# EAGLE design PowerBoard (EAGLE 9.1.3)
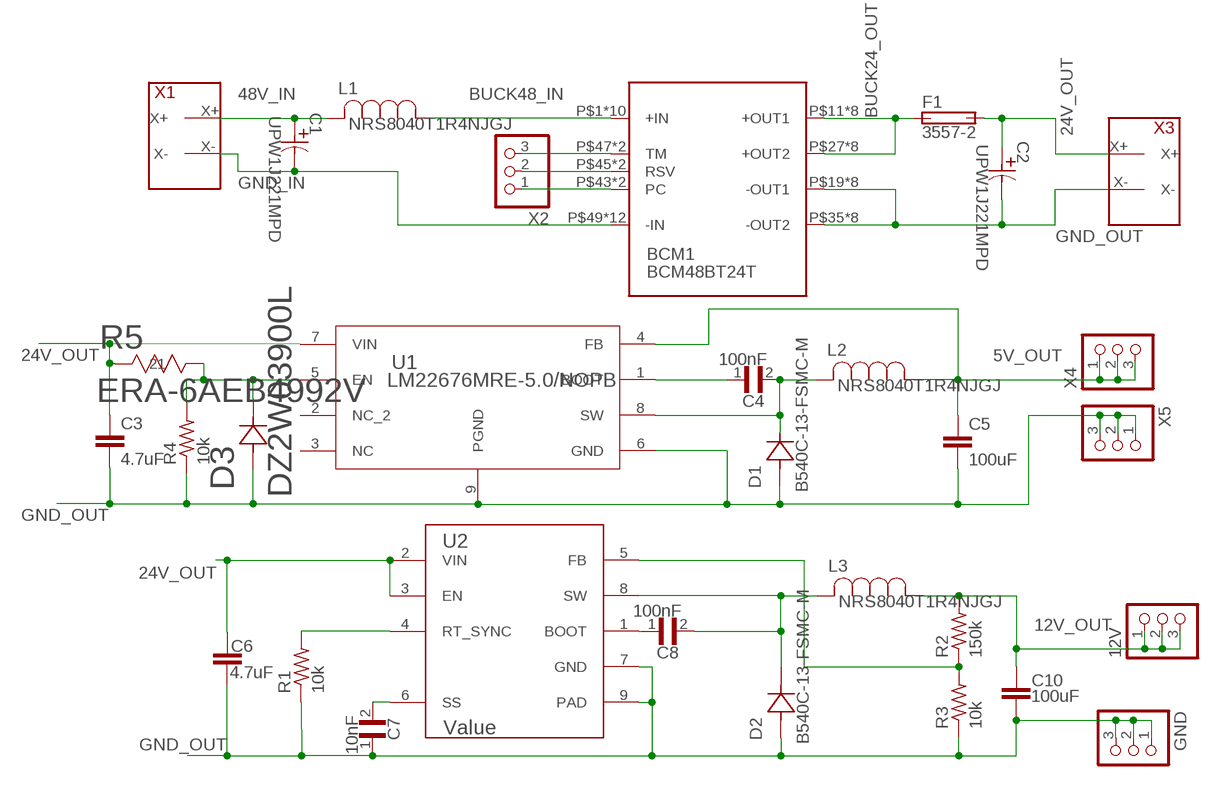
[diagram p0: schematic, sheet 1]

## Parts
12V  9-146281-0  [TE_9-146281-0]
BCM1  BCM48BT24T  [BCM48BT24T]
C1  UPW1J221MPD  [PCAP_10X20-THRU-ELECT]
C2  UPW1J221MPD  [PCAP_10X20-THRU-ELECT]
C3  4.7uF  4.7UF0603  [0603]
C4  100nF  GRM21BR60E107ME15L  [CAPC2012X135N]
C5  100uF  10UF-1210-50V-20%  [1210]
C6  4.7uF  4.7UF0603  [0603]
C7  10nF  GRM21BR60E107ME15L  [CAPC2012X135N]
C8  100nF  GRM21BR60E107ME15L  [CAPC2012X135N]
C10  100uF  10UF-1210-50V-20%  [1210]
D1  B540C-13-FSMC-M  [SMC-M]
D2  B540C-13-FSMC-M  [SMC-M]
D3  DZ2W03900L  [MINI2-F3-B]
F1  3557-2  [FUSE_3557-2]
GND  9-146281-0  [TE_9-146281-0]
L1  NRS8040T1R4NJGJ  [IND_TAIYO_NRS8040]
L2  NRS8040T1R4NJGJ  [IND_TAIYO_NRS8040]
L3  NRS8040T1R4NJGJ  [IND_TAIYO_NRS8040]
R1  10k  R-US_R0603  [R0603]
R2  150k  R-US_R0603  [R0603]
R3  10k  R-US_R0603  [R0603]
R4  10k  R-US_R0603  [R0603]
R5  ERA-6AEB4992V  [RES_ERA6A_0805]
U1  LM22676MRE-5.0/NOPB  [MRA08B]
U2  Value  LMR14050SDDAR  [DDA0008E_N]
X1  XT60  [XT60]
X2  9-146281-0  [TE_9-146281-0]
X3  XT60  [XT60]
X4  9-146281-0  [TE_9-146281-0]
X5  9-146281-0  [TE_9-146281-0]

## Nets
5V_OUT [V5]: C5.1 L2.1 U1.4(FB) X4.1 X4.2 X4.3
12V_OUT [V12]: 12V.1 12V.2 12V.3 C10.1 L3.1 R2.2
24V_OUT [V24]: C2.1 C3.1 C6.1 F1.3(2A) F1.4(2A) R5.2 U1.7(VIN) U2.2(VIN) U2.3(EN) X3.X+
48V_IN [V48]: C1.1 L1.2 X1.X+
BUCK24_OUT [V24]: BCM1.P$11(+OUT1) BCM1.P$12(+OUT1) BCM1.P$13(+OUT1) BCM1.P$14(+OUT1) BCM1.P$15(+OUT1) BCM1.P$16(+OUT1) BCM1.P$17(+OUT1) BCM1.P$18(+OUT1) BCM1.P$27(+OUT2) BCM1.P$28(+OUT2) BCM1.P$29(+OUT2) BCM1.P$30(+OUT2) BCM1.P$31(+OUT2) BCM1.P$32(+OUT2) BCM1.P$33(+OUT2) BCM1.P$34(+OUT2) F1.1(1A) F1.2(1A)
BUCK48_IN [V48]: BCM1.P$1(+IN) BCM1.P$2(+IN) BCM1.P$3(+IN) BCM1.P$4(+IN) BCM1.P$5(+IN) BCM1.P$6(+IN) BCM1.P$7(+IN) BCM1.P$8(+IN) BCM1.P$9(+IN) BCM1.P$10(+IN) L1.1
GND_IN [GND_IN]: BCM1.P$49(-IN) BCM1.P$50(-IN) BCM1.P$51(-IN) BCM1.P$52(-IN) BCM1.P$53(-IN) BCM1.P$54(-IN) BCM1.P$55(-IN) BCM1.P$56(-IN) BCM1.P$57(-IN) BCM1.P$58(-IN) BCM1.P$59(-IN) BCM1.P$60(-IN) C1.2 X1.X-
GND_OUT [GND_OUT]: BCM1.P$19(-OUT1) BCM1.P$20(-OUT1) BCM1.P$21(-OUT1) BCM1.P$22(-OUT1) BCM1.P$23(-OUT1) BCM1.P$24(-OUT1) BCM1.P$25(-OUT1) BCM1.P$26(-OUT1) BCM1.P$35(-OUT2) BCM1.P$36(-OUT2) BCM1.P$37(-OUT2) BCM1.P$38(-OUT2) BCM1.P$39(-OUT2) BCM1.P$40(-OUT2) BCM1.P$41(-OUT2) BCM1.P$42(-OUT2) C2.2 C3.2 C5.2 C6.2 C7.1 C10.2 D1.2 D2.2 D3.2 GND.1 GND.2 GND.3 R1.1 R3.1 R4.1 U1.6(GND) U1.9(PGND) U2.7(GND) U2.9(PAD) X3.X- X5.1 X5.2 X5.3
N$3: C4.1 U1.1(BOOT)
N$5 [V24]: D3.1 R4.2 R5.1 U1.5(EN)
N$6: BCM1.P$43(PC) BCM1.P$44(PC) X2.1
N$7: C4.2 D1.1 L2.2 U1.8(SW)
N$8: BCM1.P$45(RSV) BCM1.P$46(RSV) X2.2
N$9: BCM1.P$47(TM) BCM1.P$48(TM) X2.3
N$10: C7.2 U2.6(SS)
N$11: R1.2 U2.4(RT_SYNC)
N$12: C8.1 U2.1(BOOT)
N$13: C8.2 D2.1 L3.2 U2.8(SW)
N$14: R2.1 R3.2 U2.5(FB)
Unconnected: U1.2(NC_2) U1.3(NC)

## Library data of the parts
12V GND X2 X4 X5 = header_connector:9-146281-0: AMPMODU 40 Position Through-Hole Single Row Straight 2.54 mm Breakaway Header; AVAILABILITY: Good; CENTERLINE_PITCH: 2.54 mm[.1 in]; COMMENT: 9-146281-0; DESCRIPTION: 40 MODII HDR SRST B/A .100CL; EU_ROHS_COMPLIANCE: Compliant; LINK: http://www.te.com/usa-en/product-9-146281-0.html; MF: TE Connectivity; MP: 9-146281-0; NUMBER_OF_POSITIONS: 40; PACKAGE: FakePackage u; PRICE: 2.90 USD; PRODUCT_TYPE: Connector
BCM1 = BCM48BT24:BCM48BT24T
C1 C2 = CAP220uFTH:UPW1J221MPD; MANUFACTURER_PART_NUMBER: UPW1J221MPD; VENDOR: Nichicon
C3 C6 = SparkFun-Capacitors:4.7UF: 4.7µF ceramic capacitors A capacitor is a passive two-terminal electrical component used to store electrical energy temporarily in an electric field.; PROD_ID: CAP-08280
C4 C7 C8 = GRM21BR60E107ME15L:GRM21BR60E107ME15L: Cap Ceramic 100uF 2.5V X5R 20% SMD 0805 85°C Embossed Plastic T/R; AVAILABILITY: Unavailable; DESCRIPTION: Cap Ceramic 100uF 2.5V X5R 20% SMD 0805 85°C Embossed Plastic T/R; MF: Murata Electronics; MP: GRM21BR60E107ME15L; PACKAGE: 0805 Murata; PRICE: 0.64 USD
C5 C10 = SparkFun-Capacitors:10UF: 10.0µF ceramic capacitors A capacitor is a passive two-terminal electrical component used to store electrical energy temporarily in an electric field.; PROD_ID: CAP-09824; VALUE: 10uF
D1 D2 = DIO_B540C-13-FSMC:B540C-13-F; MANUFACTURER_PART_NUMBER: B540C13F; VENDOR: Diodes Inc
D3 = 3.9V_Zener_Diode:DZ2W03900L; MANUFACTURER_PART_NUMBER: DZ2W03900L; VENDOR: Panasonic
F1 = Fuse Holder 3557-2:3557-2: Clip; Auto Clips & Holders; 2-1 Holder For Standard & Low Profile Mini Fuses; AVAILABILITY: Good; DESCRIPTION: Clip; Auto Clips & Holders; 2-1 Holder For Standard & Low Profile Mini Fuses; MF: Keystone; MP: 3557-2; PACKAGE: None; PRICE: 0.82 USD
L1-L3 = IND_smd_1uH_6A:NRS8040T1R4NJGJ; MANUFACTURER_PART_NUMBER: NRS8040T1R4NJGJ; VENDOR: TAIYO YUDEN
R1-R4 = resistor:R-US_: RESISTOR, American symbol
R5 = 50k 0805 resistor:ERA-6AEB4992V; MANUFACTURER_PART_NUMBER: ERA6AEB4992V; VENDOR: Panasonic
U1 = LM2267:LM22676MRE-5.0/NOPB; MANUFACTURER_PART_NUMBER: LM22676MRE5.0NOPB; VENDOR: National Semiconductor
U2 = 24vto12v:LMR14050SDDAR; APPLICATION_BUILDNUMBER: *; COMPTYPE: IC; MANUFACTURER: Texas Instruments; MANUFACTURER_NAME: Texas Instruments; MANUFACTURER_PART_NUMBER: LMR14050SDDAR; MOUNTTYPE: SMT; PACKAGEREFERENCE: DDA0008E; PARTNUMBER: LMR14050SDDAR; PIN_COUNT: 9; REFDES: RefDes; ROHS: Y; TYPE: TYPE
X1 X3 = XT60:XT60

## Net classes
0 default: width 0.61 mm, clearance 0.381 mm
1 V48: width 2.54 mm, clearance 0.381 mm
2 V24: clearance 0.381 mm
3 V12: width 0.762 mm, clearance 0.381 mm
4 V5: width 1.016 mm, clearance 0.381 mm
5 GND_IN: width 2.54 mm, clearance 0.381 mm
6 GND_OUT: width 0.406 mm, clearance 0.381 mm

## Board
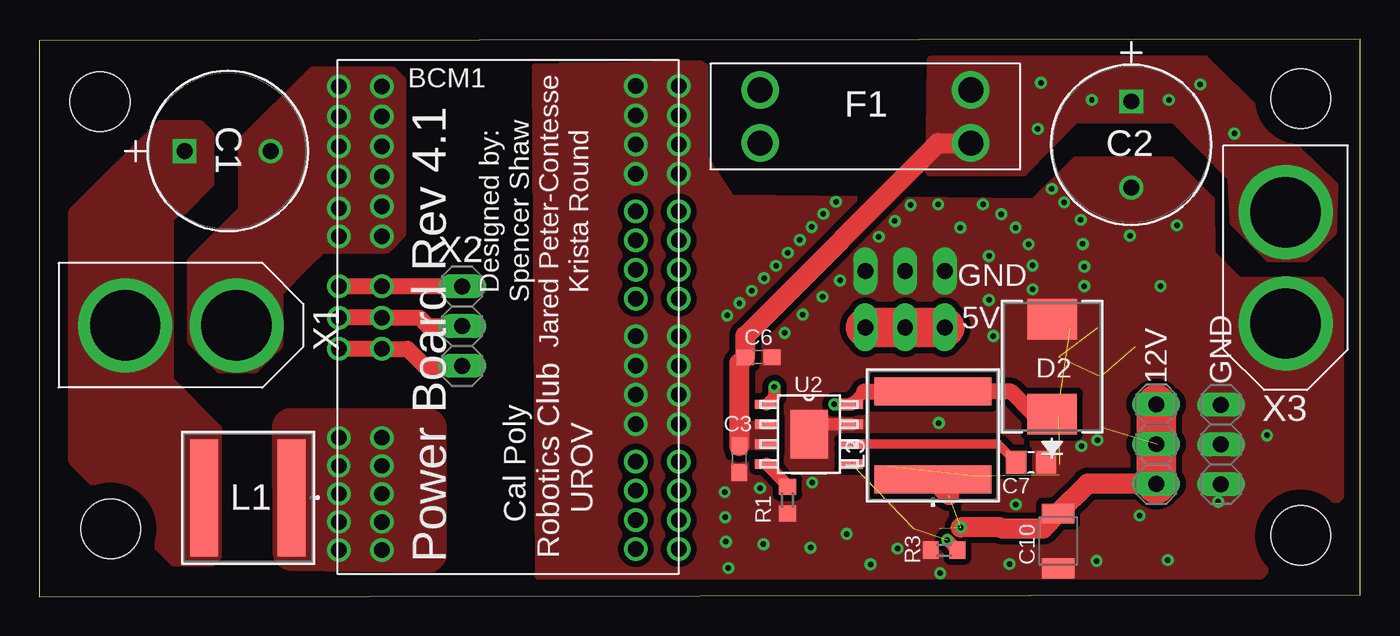
[diagram p1: board, top side]
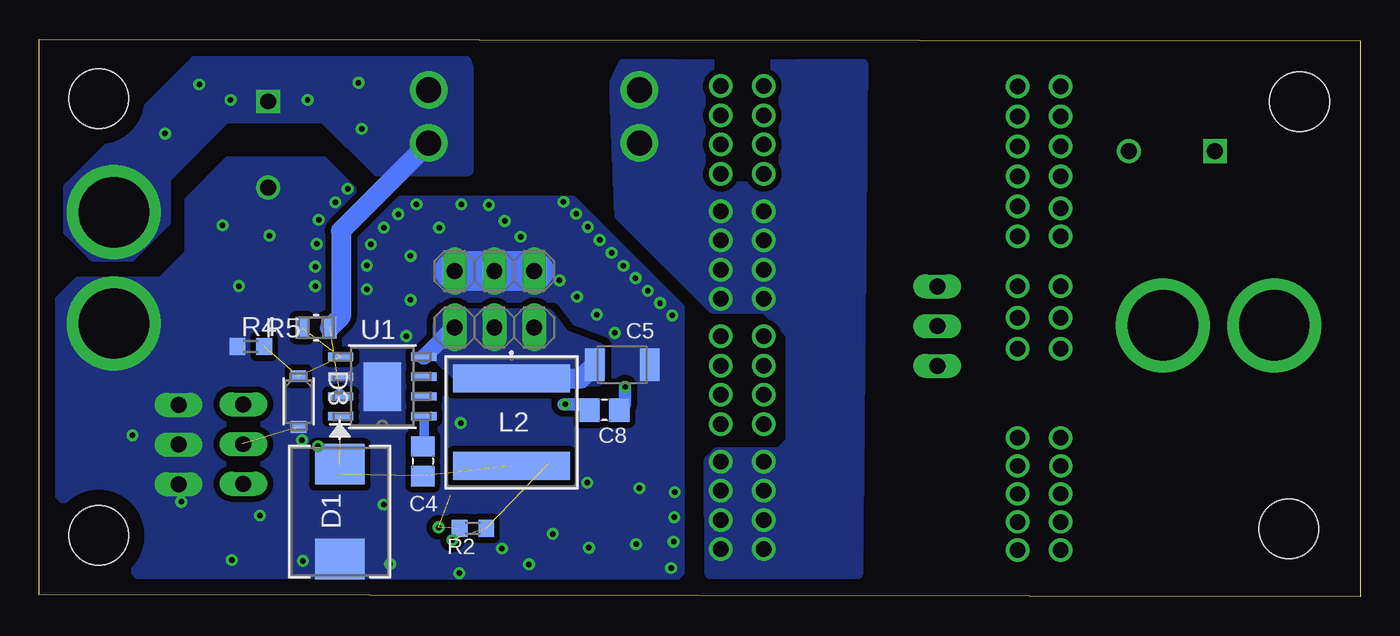
[diagram p2: board, bottom side, seen from below]

Size 84.48 x 35.66 mm. Coordinates in mm from the lower left corner, seen from the top.
Outline: 0,0 84.48,0.1 84.48,35.66 0,35.56 0,0
Copper layers (1*16): Top 0.035mm / dielectric 1.5mm / Bottom 0.035mm
Design rules "default *": minimum track width 6mil, minimum drill 0.35mm, track to track 6mil, track to pad 6mil, pad to pad 6mil, via to via 6mil, smd to smd 6mil, copper to edge 40mil, drill to drill 6mil, minimum pad ring 10mil, minimum via ring 8mil, stop-mask expansion 4mil, vias tented up to drill 0mil, thermal gap 10mil
Holes 3.81 mm at 3.89,31.65 4.57,4.34 80.67,3.91 80.67,31.85

### Footprints (pad centres in the part's own frame; a part is rotated, then mirrored left to right if it is on the bottom)
TE_9-146281-0 = drill 1.016 long: 1 1.27,0; 2 3.81,0; 3 6.35,0
BCM48BT24T = drill 0.99 pad 1.5: P$1 7.95,14.89; P$2 10.7,14.89; P$3 10.7,13.1; P$4 7.95,13.1; P$5 10.7,11.31; P$6 7.95,11.31; P$7 10.719,9.52; P$8 7.95,9.52; P$9 10.7,7.73; P$10 7.95,7.73; P$11 -11.04,14.85; P$12 -8.29,14.85; P$13 -11.04,12.98; P$14 -8.29,12.98; P$15 -11.04,11.11; P$16 -8.29,11.11; P$17 -11.04,9.24; P$18 -8.29,9.24; P$19 -11.04,6.85; P$20 -8.29,6.85; P$21 -11.04,4.98; P$22 -8.29,4.98; P$23 -11.04,3.11; P$24 -8.29,3.11; P$25 -11.04,1.24; P$26 -8.29,1.24; P$27 -11.04,-1.16; P$28 -8.29,-1.16; P$29 -11.04,-3.03; P$30 -8.29,-3.03; P$31 -11.04,-4.9; P$32 -8.29,-4.9; P$33 -11.04,-6.77; P$34 -8.29,-6.77; P$35 -11.04,-9.16; P$36 -8.29,-9.16; P$37 -11.04,-11.03; P$38 -8.29,-11.03; P$39 -11.04,-12.9; P$40 -8.29,-12.9; P$41 -11.04,-14.77; P$42 -8.29,-14.77; P$43 10.7,2.04; P$44 7.95,2.04; P$45 10.7,0.04; P$46 7.95,0.04; P$47 10.7,-1.96; P$48 7.95,-1.96; P$49 10.7,-5.17; P$50 7.95,-5.17; P$51 10.7,-6.96; P$52 7.95,-7.09; P$53 10.7,-9; P$54 7.95,-9; P$55 10.7,-10.92; P$56 7.95,-10.92; P$57 10.7,-12.83; P$58 7.95,-12.83; P$59 10.7,-14.75; P$60 7.95,-14.75
PCAP_10X20-THRU-ELECT = drill 1.016 pad 1.524 square: 1 -2.972,0 | drill 1.016 pad 1.524: 2 2.54,0
0603 = smd 1.1 x 1: 1 -0.85,0; 2 0.85,0
CAPC2012X135N = smd 1.3 x 1.5: 1 -0.95,0; 2 0.95,0
1210 = smd 1.27 x 2.06: 1 -1.755,0; 2 1.755,0
SMC-M = smd 2.587 x 3.18: 1 -3.026,0; 2 3.026,0
MINI2-F3-B = smd 0.762 x 0.991: 1 -1.626,0; 2 1.626,0
FUSE_3557-2 = drill 1.6: 1 -6.735,1.7; 2 -6.735,-1.7; 3 6.735,1.7; 4 6.735,-1.7
IND_TAIYO_NRS8040 = smd 1.791 x 7.493: 1 -2.8,0; 2 2.8,0
R0603 = smd 1 x 1.1: 1 -0.85,0; 2 0.85,0
RES_ERA6A_0805 = smd 0.864 x 1.346: 1 -0.876,0; 2 0.876,0
MRA08B = smd 1.6 x 0.533: 1 -2.654,1.905; 2 -2.654,0.635; 3 -2.654,-0.635; 4 -2.654,-1.905; 5 2.654,-1.905; 6 2.654,-0.635; 7 2.654,0.635; 8 2.654,1.905 | smd 2.413 x 3.099: 9 0,0
DDA0008E_N = smd 1.45 x 0.6: 1 -2.725,1.905; 2 -2.725,0.635; 3 -2.725,-0.635; 4 -2.725,-1.905; 5 2.725,-1.905; 6 2.725,-0.635; 7 2.725,0.635; 8 2.725,1.905 | smd 2.4 x 3.1: 9 0,0
XT60 = drill 4.5 pad 6: X+ 0,-3.56; X- 0,3.56

### Placement (x,y rotation side)
12V  71.42,5.94 90 top
BCM1  29.87,17.88 180 top
C1  12.27,28.5 0 top
C2  69.82,28.7 270 top
C3  44.75,8.79 270 top
C4  59.94,8.66 270 bottom
C5  47.19,14.83 0 bottom
C6  46,15.32 0 top
C7  63.42,8.59 180 top
C8  48.34,11.94 180 bottom
C10  65.15,3.56 270 top
D1  65.25,5.44 270 bottom
D2  64.77,14.71 90 top
D3  67.89,12.47 270 bottom
F1  52.83,30.71 0 top
GND  75.56,5.92 90 top
L1  13.36,6.32 180 top
L2  54.28,11.15 270 bottom
L3  57.15,10.31 90 top
R1  47.85,6.17 90 top
R2  56.74,4.37 180 bottom
R3  57.86,2.97 0 top
R4  70.94,16 0 bottom
R5  66.78,17.2 0 bottom
U1  62.53,13.44 180 bottom
U2  49.23,10.39 0 top
X1  9.07,17.35 270 top
X2  27.05,13.49 90 top
X3  79.71,21.03 180 top
X4  51.56,17.22 180 bottom
X5  51.56,20.83 180 bottom

### Tracks (layer width: path | path; a pad name or v marks a point on that pad's centre or on a via)
5V_OUT
  Top 2.54: X4.1 X4.2 X4.3
  Bottom 1.016: U1.4 58,17.22 X4.3
  Bottom 1.27: L2.1 49.83,13.95 C5.1
  pour Bottom (no thermals): 51.1,16.51 48.87,15.67 48.95,14.05 51.36,14.1 57.4,14.1 57.4,14.2 58.67,15.47 58.67,17.42 58.27,17.83 52.78,17.83 52.15,17.86
12V_OUT  (via drill 0.35)  (2 unrouted)
  Top 1.27: 58.18,6.49 L3.1 | v58.93,4.43 61.5,4.43 61.58,4.34 64.18,4.34 C10.1 67.05,7.21 12V.1
  Top 2.54: 12V.3 12V.2 12V.1
24V_OUT  (via drill 0.35)  (1 unrouted)
  Top 1.27: C3.1 44.75,14.92 C6.1 45.15,16.68 57.48,29.01 F1.4
  Bottom 0.813: U1.7 65.28,12.89
  Bottom 1.27: F1.4 65.18,23.4 65.18,17.92 R5.2
  other vias: 64.06,32.87 74.24,32.77 76.43,29.62 63.86,29.92 67.31,31.78 72.24,31.78
  pour Top (no thermals): 57.05,34.32 56.95,27.18 62.89,27.15 66.27,30.58 72.57,30.53 76.3,26.77 76.4,23.93 78.64,21.69 81,21.69 82.68,23.32 82.78,26.29 74.45,34.39
  pour Bottom (no thermals): 57.1,33.83 57.1,27.28 62.84,27.28 66.24,30.66 72.59,30.66 76.45,26.77 76.45,24 78.66,21.79 81,21.82 82.55,23.37 82.55,26.16 74.42,34.29 57.33,34.29 57.23,34.19
  pour Top (no thermals): 47.19,9.47 44.53,9.47 44.32,9.68 44.32,11.02 44.45,11.15 47.12,11.15 47.19,11.15 47.19,9.63
48V_IN
  pour Top (no thermals): 11.43,10.77 11.43,2.57 11.23,2.36 11.02,2.16 8.64,2.16 2.13,8.66 2.13,18.24 2.13,24.61 7.77,30.25 10.26,30.25 10.79,29.72 10.95,29.57 10.95,28.42 10.95,26.42 9.17,24.64 8.84,24.64 8.36,24.16 8.36,16.51 8.36,13.84
BUCK24_OUT
  pour Bottom (no thermals): 41.55,1.52 32.18,1.5 31.88,34.01 40.28,33.96 47.07,34.04 47.65,32.77 47.29,24.41 41.38,18.49 38.07,18.49 36.35,16.76 36.35,9.96 37.13,9.17 41.1,9.17 41.58,8.69
BUCK48_IN
  pour Top (no thermals): 16.18,2.9 24.82,2.77 24.82,10.79 16.15,10.82
GND_IN
  pour Top (no thermals): 15.37,17.48 15.37,19.48 17.14,21.26 18.08,22.2 21.74,22.2 22.22,22.2 22.43,22.4 23.24,23.22 23.24,32.64 23.24,33.02 22.94,33.32 22.61,33.66 18.97,33.66 17.48,33.66 12.95,29.13 12.95,24.71 9.7,21.46 9.7,16.36 11.28,14.78 11.51,14.55 12.93,14.55 13.82,14.55 14.68,15.42 15.37,16.1
GND_OUT  (via drill 0.35)  (1 unrouted)
  Top 0.813: U2.7 49.86,11.02 U2.9
  Bottom 2.54: X5.1 X5.3 X5.2
  other vias: 46.1,6.93 49.43,7.29 57.52,11.11 54.89,3.07 75.39,6.07 71.5,9.75 61.52,24.46 64.74,26.09 63.53,19.66 67.67,10.01 70.36,5.18 44.07,1.83 43.87,5.08 43.99,17.98 47.12,21.16 53.7,23.01 49.4,23.65 47.68,16.87 57.61,1.5 62.04,2.08 66.83,19.86 78.51,10.31 71.7,19.86 49.33,3.12 62.45,5.89 67.61,2.29 44.78,18.77 45.57,19.56 46.35,20.37 47.88,22 48.64,22.81 50.14,24.49 50.95,25.25 50.09,19.18 48.82,18.03 51.21,20.22 54.71,24.03 63.27,22.53 62.43,23.6 60.35,25.1 53.16,2.06 51.64,4.01 46.3,3.35 72.16,2.34 66.6,24.1 66.73,22.56 66.83,21.11 66.65,9.63 60.73,18.97 43.92,3.51 43.84,6.68 55.73,25.04 65.53,25.22 63.53,21.18 57.48,25.1 58.9,23.6 60.73,21.79 61.01,16.66 69.75,23.09 72.75,23.75
  pour Top (rank 2, no thermals): 31.72,33.89 31.89,1.31 78.16,1.3 83.26,6.43 83.26,18.95 82.04,20.24 76.73,20.24 75.01,21.97 74.98,25.4 72.42,27.94 66.24,27.94 63.58,25.3 44.27,25.53 42.58,28.12 42.58,33.91 42.28,34.13
  pour Bottom (rank 2, no thermals): 43.41,1.52 43.41,18.52 50.32,25.43 63.73,25.43 66.24,27.94 72.44,27.94 74.98,25.4 74.98,22 76.73,20.24 82.04,20.24 84.25,18.03 84.25,7.39 77.22,0.36 44.58,0.36
N$3
  Bottom 0.61: U1.1 59.88,9.67 C4.1
N$5  (3 unrouted)
N$6
  Top 1.016: BCM1.P$43 BCM1.P$44 23.55,15.84 24.64,14.76 X2.1
N$7  (3 unrouted)
  Bottom 0.813: D1.1 65.19,7.83
N$8
  Top 1.016: 19.28,17.73 BCM1.P$45 BCM1.P$46 24.32,17.84 24.87,17.3 X2.2
N$9
  Top 1.016: BCM1.P$48 BCM1.P$47 X2.3
N$10
  Top 0.61: C7.2 61.31,9.75 U2.6
N$11
  Top 0.813: U2.4 47.85,7.13 R1.2
N$12  (via drill 0.35)
  Top 0.813: U2.1 47.02,12.81 v47.02,13.41
  Bottom 0.813: C8.1 47.02,12.31 v47.02,13.41
N$13  (via drill 0.35)
  Top 0.813: 52.77,13.11 U2.8 51.9,12.34 51.9,12.29 v50.85,12.29
  Top 1.016: 52.77,13.11 L3.2 62.12,13.11 63.55,11.68 D2.1
  Bottom 0.813: 50.95,12.29 v50.85,12.29 49.64,12.29 C8.2
N$14  (via drill 0.35)  (2 unrouted)
  Top 0.813: v58.06,3.62 R3.2

### Text on the board
tPlace: Designed by: / Spencer Shaw / Jared Peter-Contesse / Krista Round | Power Board Rev 4.1 | Cal Poly / Robotics Club / UROV
tNames: GND | 5V